# EAGLE design Test Pack (EAGLE 7.1.0)
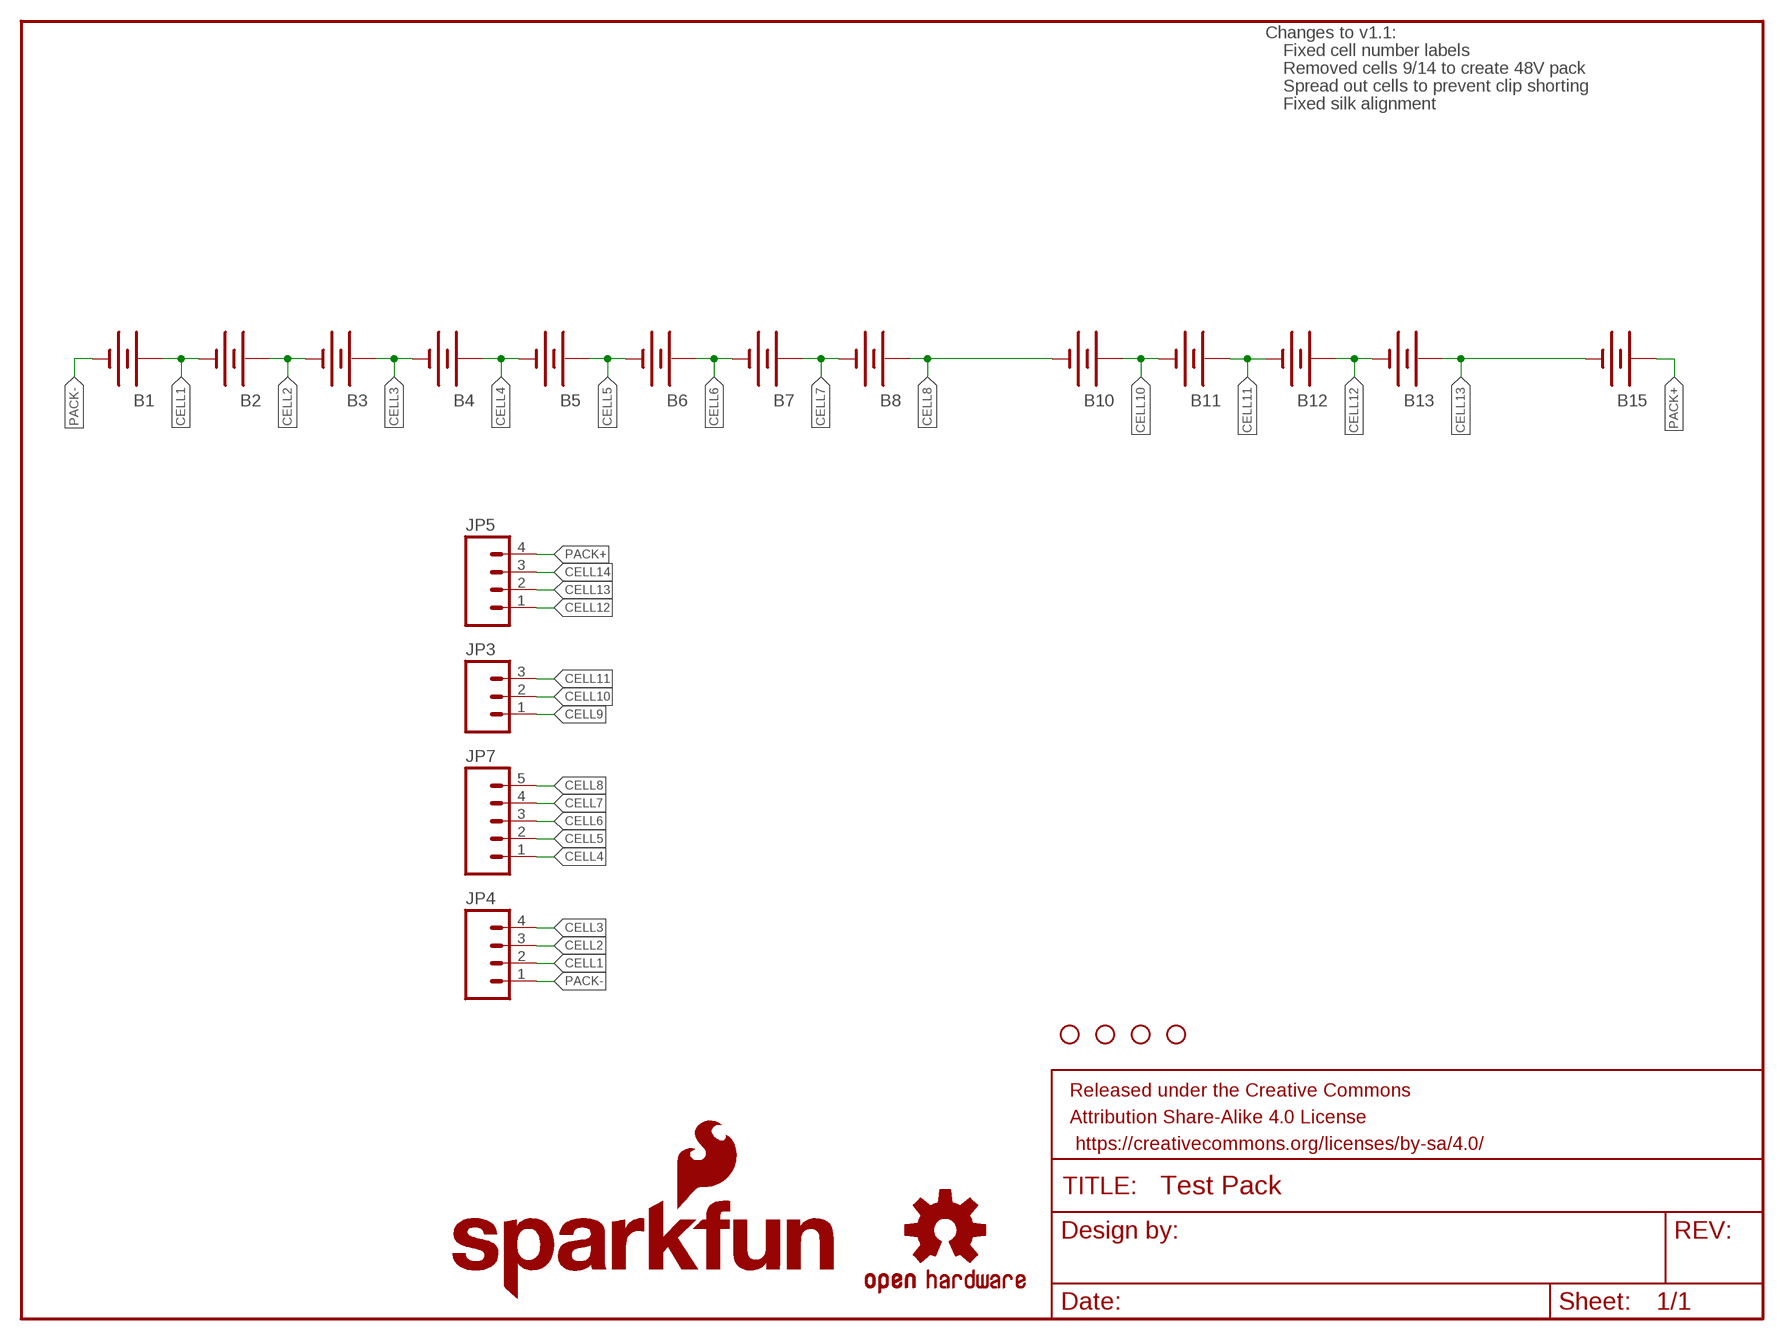
[diagram p0: schematic, sheet 1]

## Parts
B1  BATTERY18650  [BATTERY_18650-HOLDER]
B2  BATTERY18650  [BATTERY_18650-HOLDER]
B3  BATTERY18650  [BATTERY_18650-HOLDER]
B4  BATTERY18650  [BATTERY_18650-HOLDER]
B5  BATTERY18650  [BATTERY_18650-HOLDER]
B6  BATTERY18650  [BATTERY_18650-HOLDER]
B7  BATTERY18650  [BATTERY_18650-HOLDER]
B8  BATTERY18650  [BATTERY_18650-HOLDER]
B10  BATTERY18650  [BATTERY_18650-HOLDER]
B11  BATTERY18650  [BATTERY_18650-HOLDER]
B12  BATTERY18650  [BATTERY_18650-HOLDER]
B13  BATTERY18650  [BATTERY_18650-HOLDER]
B15  BATTERY18650  [BATTERY_18650-HOLDER]
FRAME1  FRAME-LETTER  [CREATIVE_COMMONS]
JP3  M03JST-PTH  [JST-3-PTH]
JP4  M04JST-PTH  [JST-4-PTH]
JP5  M04JST-PTH  [JST-4-PTH]
JP7  M05JST  [JST-5-PTH]
LOGO1  SFE_LOGO_NAME_FLAME.1_INCH  [SFE_LOGO_NAME_FLAME_.1]
STANDOFF1  STAND-OFF  [STAND-OFF]
STANDOFF2  STAND-OFF  [STAND-OFF]
STANDOFF3  STAND-OFF  [STAND-OFF]
STANDOFF4  STAND-OFF  [STAND-OFF]
U$7  OSHW-LOGOS  [OSHW-LOGO-S]

## Nets
CELL1: B1.PWR@1(+) B2.GND@1(-) JP4.2
CELL2: B2.PWR@1(+) B3.GND@1(-) JP4.3
CELL3: B3.PWR@1(+) B4.GND@1(-) JP4.4
CELL4: B4.PWR@1(+) B5.GND@1(-) JP7.1
CELL5: B5.PWR@1(+) B6.GND@1(-) JP7.2
CELL6: B6.PWR@1(+) B7.GND@1(-) JP7.3
CELL7: B7.PWR@1(+) B8.GND@1(-) JP7.4
CELL8: B8.PWR@1(+) B10.GND@1(-) JP7.5
CELL9: JP3.1
CELL10: B10.PWR@1(+) B11.GND@1(-) JP3.2
CELL11: B11.PWR@1(+) B12.GND@1(-) JP3.3
CELL12: B12.PWR@1(+) B13.GND@1(-) JP5.1
CELL13: B13.PWR@1(+) B15.GND@1(-) JP5.2
CELL14: JP5.3
PACK+: B15.PWR@1(+) JP5.4
PACK-: B1.GND@1(-) JP4.1

## Notes on the sheet
- Changes to v1.1:
- Fixed cell number labels
- Removed cells 9/14 to create 48V pack
- Spread out cells to prevent clip shorting
- Fixed silk alignment

## Library data of the parts
B1-B8 B10-B13 B15 = SparkFun-Electromechanical:BATTERY: Battery Holders Various common sizes : AA, AAA, 18650 (PRT-12895), 20mm coin cell and 12mm coin cell. 20MM_4LEGS, BATT-10373
FRAME1 = SparkFun-Aesthetics:FRAME-LETTER: Schematic Frame Standard 8.5x11 US Letter frame
JP3 = SparkFun-Connectors:M03: Header 3 Standard 3-pin 0.1" header. Use with straight break away headers (SKU : PRT-00116), right angle break away headers (PRT-00553), swiss pins (PRT-00743), machine pins (PRT-00117), and female headers (PRT-00115). Molex polarized connector foot print use with SKU : PRT-08232 with associated crimp pins and housings.; SKU: PRT-09915
JP4 JP5 = SparkFun-Connectors:M04: Header 4 Standard 4-pin 0.1" header. Use with straight break away headers (SKU : PRT-00116), right angle break away headers (PRT-00553), swiss pins (PRT-00743), machine pins (PRT-00117), and female headers (PRT-00115). Molex polarized connector foot print use with SKU : PRT-08231 with associated crimp pins and housings. 1MM SMD Version SKU: PRT-10208; SKU: PRT-09916
JP7 = SparkFun-Connectors:M05: Header 5 Standard 5-pin 0.1" header. Use with straight break away headers (SKU : PRT-00116), right angle break away headers (PRT-00553), swiss pins (PRT-00743), machine pins (PRT-00117), and female headers (PRT-00115). Molex polarized connector foot print use with SKU : PRT-08230 with associated crimp pins and housings.
LOGO1 = SparkFun-Aesthetics:SFE_LOGO_NAME_FLAME: SFE Logo, name and flame This is the SparkFun full logo. The logo on the schematic will always be the same size; the package variant is the height of the flame part of the logo. Default layer for the logo on the board is tSilk.
STANDOFF1-STANDOFF4 = SparkFun-Electromechanical:STAND-OFF: #4 Stand Off This is the mechanical footprint for a #4 phillips button head screw. Use the keepout ring to avoid running the screw head into surrounding components. SKU : PRT-00447
U$7 = SparkFun-Aesthetics:OSHW-LOGO: Open Source Hardware Logo This logo indicates the piece of hardware it is found on incorporates a OSHW license and/or adheres to the definition of open source hardware found here: http://freedomdefined.org/OSHW

## Board
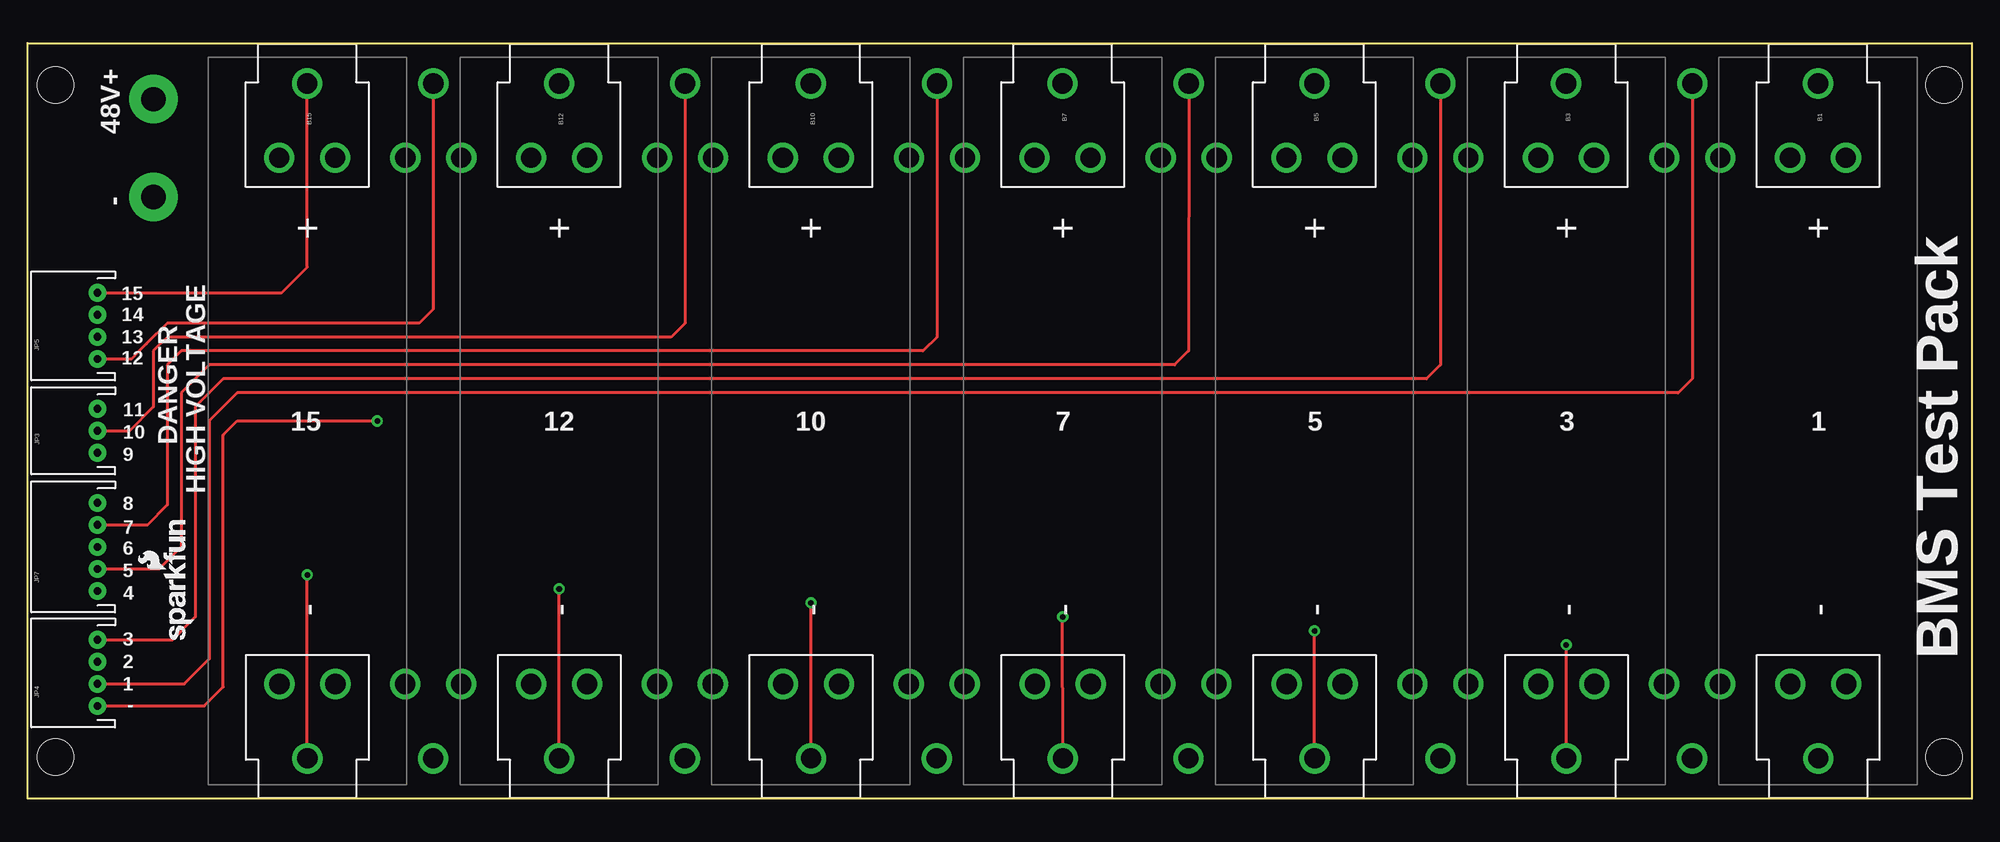
[diagram p1: board, top side]
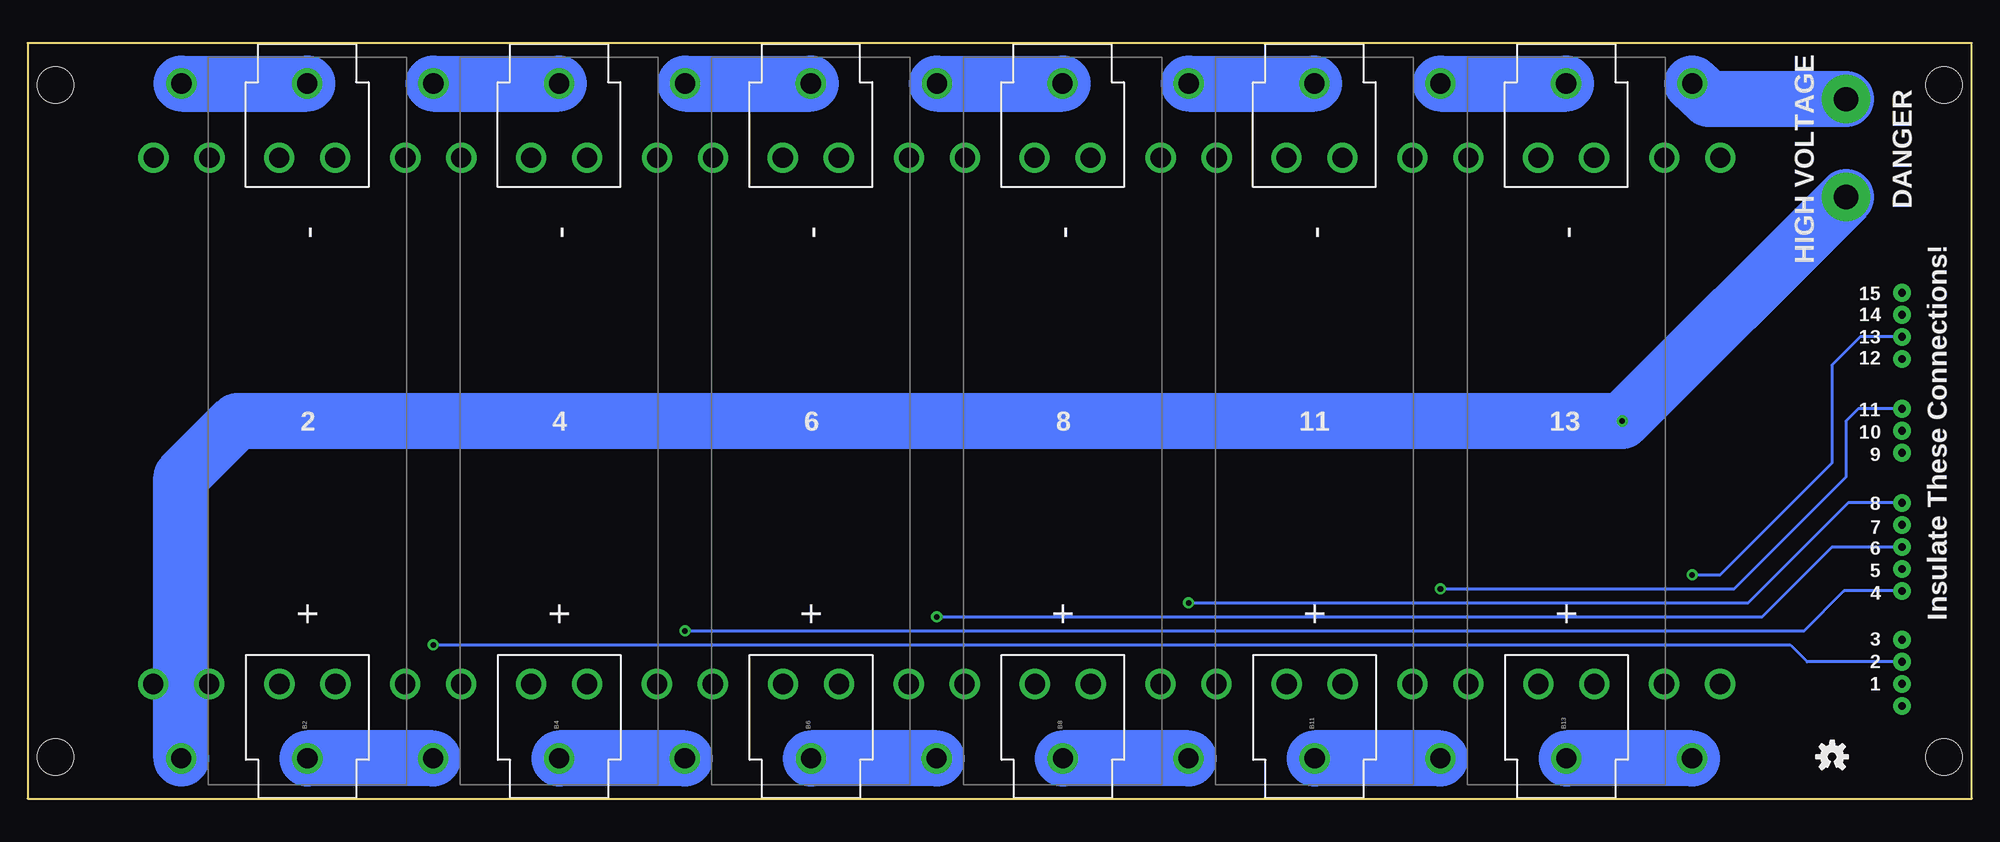
[diagram p2: board, bottom side, seen from below]

Size 176.53 x 68.58 mm. Coordinates in mm from the lower left corner, seen from the top.
Outline: 0,68.58 176.53,68.58 176.53,0 0,0 0,68.58
Copper layers (1*16): Top 0.035mm / dielectric 1.5mm / Bottom 0.035mm
Design rules "default *": minimum track width 8mil, minimum drill 20mil, track to track 8mil, track to pad 8mil, pad to pad 8mil, via to via 8mil, smd to smd 8mil, copper to edge 8mil, drill to drill 8mil, minimum pad ring 12mil, minimum via ring 10mil, stop-mask expansion 4mil, vias tented up to drill 20mil, thermal gap 10mil

### Footprints (pad centres in the part's own frame; a part is rotated, then mirrored left to right if it is on the bottom)
BATTERY_18650-HOLDER = drill 1.829: GND@1 30.628,0.01; GND@2 23.88,2.55; GND@3 23.88,-2.53; PWR@1 -30.628,-0.01; PWR@2 -23.88,2.53; PWR@3 -23.88,-2.55
JST-3-PTH = drill 0.7 pad 1.6: 1 -2,0; 2 0,0; 3 2,0
JST-4-PTH = drill 0.7 pad 1.6: 1 -3,0; 2 -1,0; 3 1,0; 4 3,0
JST-5-PTH = drill 0.7 pad 1.6: 1 -4,0; 2 -2,0; 3 0,0; 4 2,0; 5 4,0
STAND-OFF = hole 3.302: 0,0

### Placement (x,y rotation side)
B1  162.56,34.29 270 top
B2  151.13,34.29 90 bottom
B3  139.7,34.29 270 top
B4  128.27,34.29 90 bottom
B5  116.84,34.29 270 top
B6  105.41,34.29 90 bottom
B7  93.98,34.29 270 top
B8  82.55,34.29 90 bottom
B10  71.12,34.29 270 top
B11  59.69,34.29 90 bottom
B12  48.26,34.29 270 top
B13  36.83,34.29 90 bottom
B15  25.4,34.29 270 top
FRAME1  -0.65,-21.59 0 top  (outside the outline)
JP3  6.35,33.4 90 top
JP4  6.35,11.43 90 top
JP5  6.35,42.93 90 top
JP7  6.35,22.86 90 top
LOGO1  15.24,13.97 90 top
STANDOFF1  2.54,3.81 0 top
STANDOFF2  2.54,64.77 0 top
STANDOFF3  173.99,64.77 0 top
STANDOFF4  173.99,3.81 0 top
U$7  12.7,3.81 0 bottom

### Tracks (layer width: path | path; a pad name or v marks a point on that pad's centre or on a via)
CELL1
  Top 0.254: B2.GND@1 151.13,38.1 149.86,36.83 19.05,36.83 16.51,34.29 16.51,12.7 14.24,10.43 JP4.2
  Bottom 5.08: B1.PWR@1 B2.GND@1
CELL2  (via drill 0.51)
  Top 0.254: B3.GND@1 v139.7,13.97
  Bottom 0.254: v139.7,13.97 16.51,13.97 14.97,12.43 JP4.3
  Bottom 5.08: B3.GND@1 B2.PWR@1
CELL3
  Top 0.254: B4.GND@1 128.27,39.37 127,38.1 17.78,38.1 15.24,35.56 15.24,16.51 13.16,14.43 JP4.4
  Bottom 5.08: B3.PWR@1 B4.GND@1
CELL4  (via drill 0.51)
  Top 0.254: B5.GND@1 v116.84,15.24
  Bottom 0.254: v116.84,15.24 15.24,15.24 11.62,18.86 JP7.1
  Bottom 5.08: B5.GND@1 B4.PWR@1
CELL5
  Top 0.254: B6.GND@1 105.41,40.64 104.14,39.37 16.51,39.37 13.97,36.83 13.97,22.86 11.97,20.86 JP7.2
  Bottom 5.08: B5.PWR@1 B6.GND@1
CELL6  (via drill 0.51)
  Top 0.254: B7.GND@1 v93.98,16.51
  Bottom 0.254: v93.98,16.51 19.05,16.51 12.7,22.86 JP7.3
  Bottom 5.08: B7.GND@1 B6.PWR@1
CELL7
  Top 0.254: B8.GND@1 82.55,41.91 81.28,40.64 13.97,40.64 12.7,39.37 12.7,26.67 10.89,24.86 JP7.4
  Bottom 5.08: B7.PWR@1 B8.GND@1
CELL8  (via drill 0.51)
  Top 0.254: B10.GND@1 v71.12,17.78
  Bottom 0.254: v71.12,17.78 20.32,17.78 11.24,26.86 JP7.5
  Bottom 5.08: B10.GND@1 B8.PWR@1
CELL10
  Top 0.254: B11.GND@1 59.69,43.18 58.42,41.91 12.7,41.91 11.43,40.64 11.43,35.56 9.27,33.4 JP3.2
  Bottom 5.08: B10.PWR@1 B11.GND@1
CELL11  (via drill 0.51)
  Top 0.254: B12.GND@1 v48.26,19.05
  Bottom 0.254: v48.26,19.05 21.59,19.05 11.43,29.21 11.43,34.29 10.32,35.4 JP3.3
  Bottom 5.08: B12.GND@1 B11.PWR@1
CELL12
  Top 0.254: B13.GND@1 36.83,44.45 35.56,43.18 12.7,43.18 10.79,41.27 10.16,40.64 9.45,39.93 JP5.1
  Bottom 5.08: B12.PWR@1 B13.GND@1
CELL13  (via drill 0.51)
  Top 0.254: B15.GND@1 v25.4,20.32
  Bottom 0.254: v25.4,20.32 22.86,20.32 12.7,30.48 12.7,39.37 10.14,41.93 JP5.2
  Bottom 5.08: B15.GND@1 B13.PWR@1
PACK+  (via drill 2.2 pad 4.4)
  Top 0.254: JP5.4 23.07,45.93 25.4,48.26 B15.PWR@1
  Bottom 5.08: v11.43,63.5 23.89,63.5 B15.PWR@1
PACK-  (via drill 0.51, 2.2 pad 4.4)
  Top 0.254: JP4.1 16.05,8.43 17.78,10.16 17.78,33.02 19.05,34.29 v31.75,34.29
  Bottom 5.08: B1.GND@1 162.56,29.21 157.48,34.29 v31.75,34.29 v11.43,54.61

### Text on the board
tPlace: 48V+ | - | 15 | 14 | 13 | 12 | 11 | 10 | 15 | 12 | 10 | 7 | 5 | 3 | 1 | 9 | DANGER | HIGH VOLTAGE | 8 | 7 | 6 | 5 | 4 | 3 | 2 | BMS Test Pack | 1 | -
bPlace: HIGH VOLTAGE | DANGER | Insulate These Connections! | 15 | 14 | 13 | 12 | 11 | 10 | 13 | 11 | 8 | 6 | 4 | 2 | 9 | 8 | 7 | 6 | 5 | 4 | 3 | 2 | 1